# EAGLE design tanfolyamrobot (EAGLE 9.6.2)
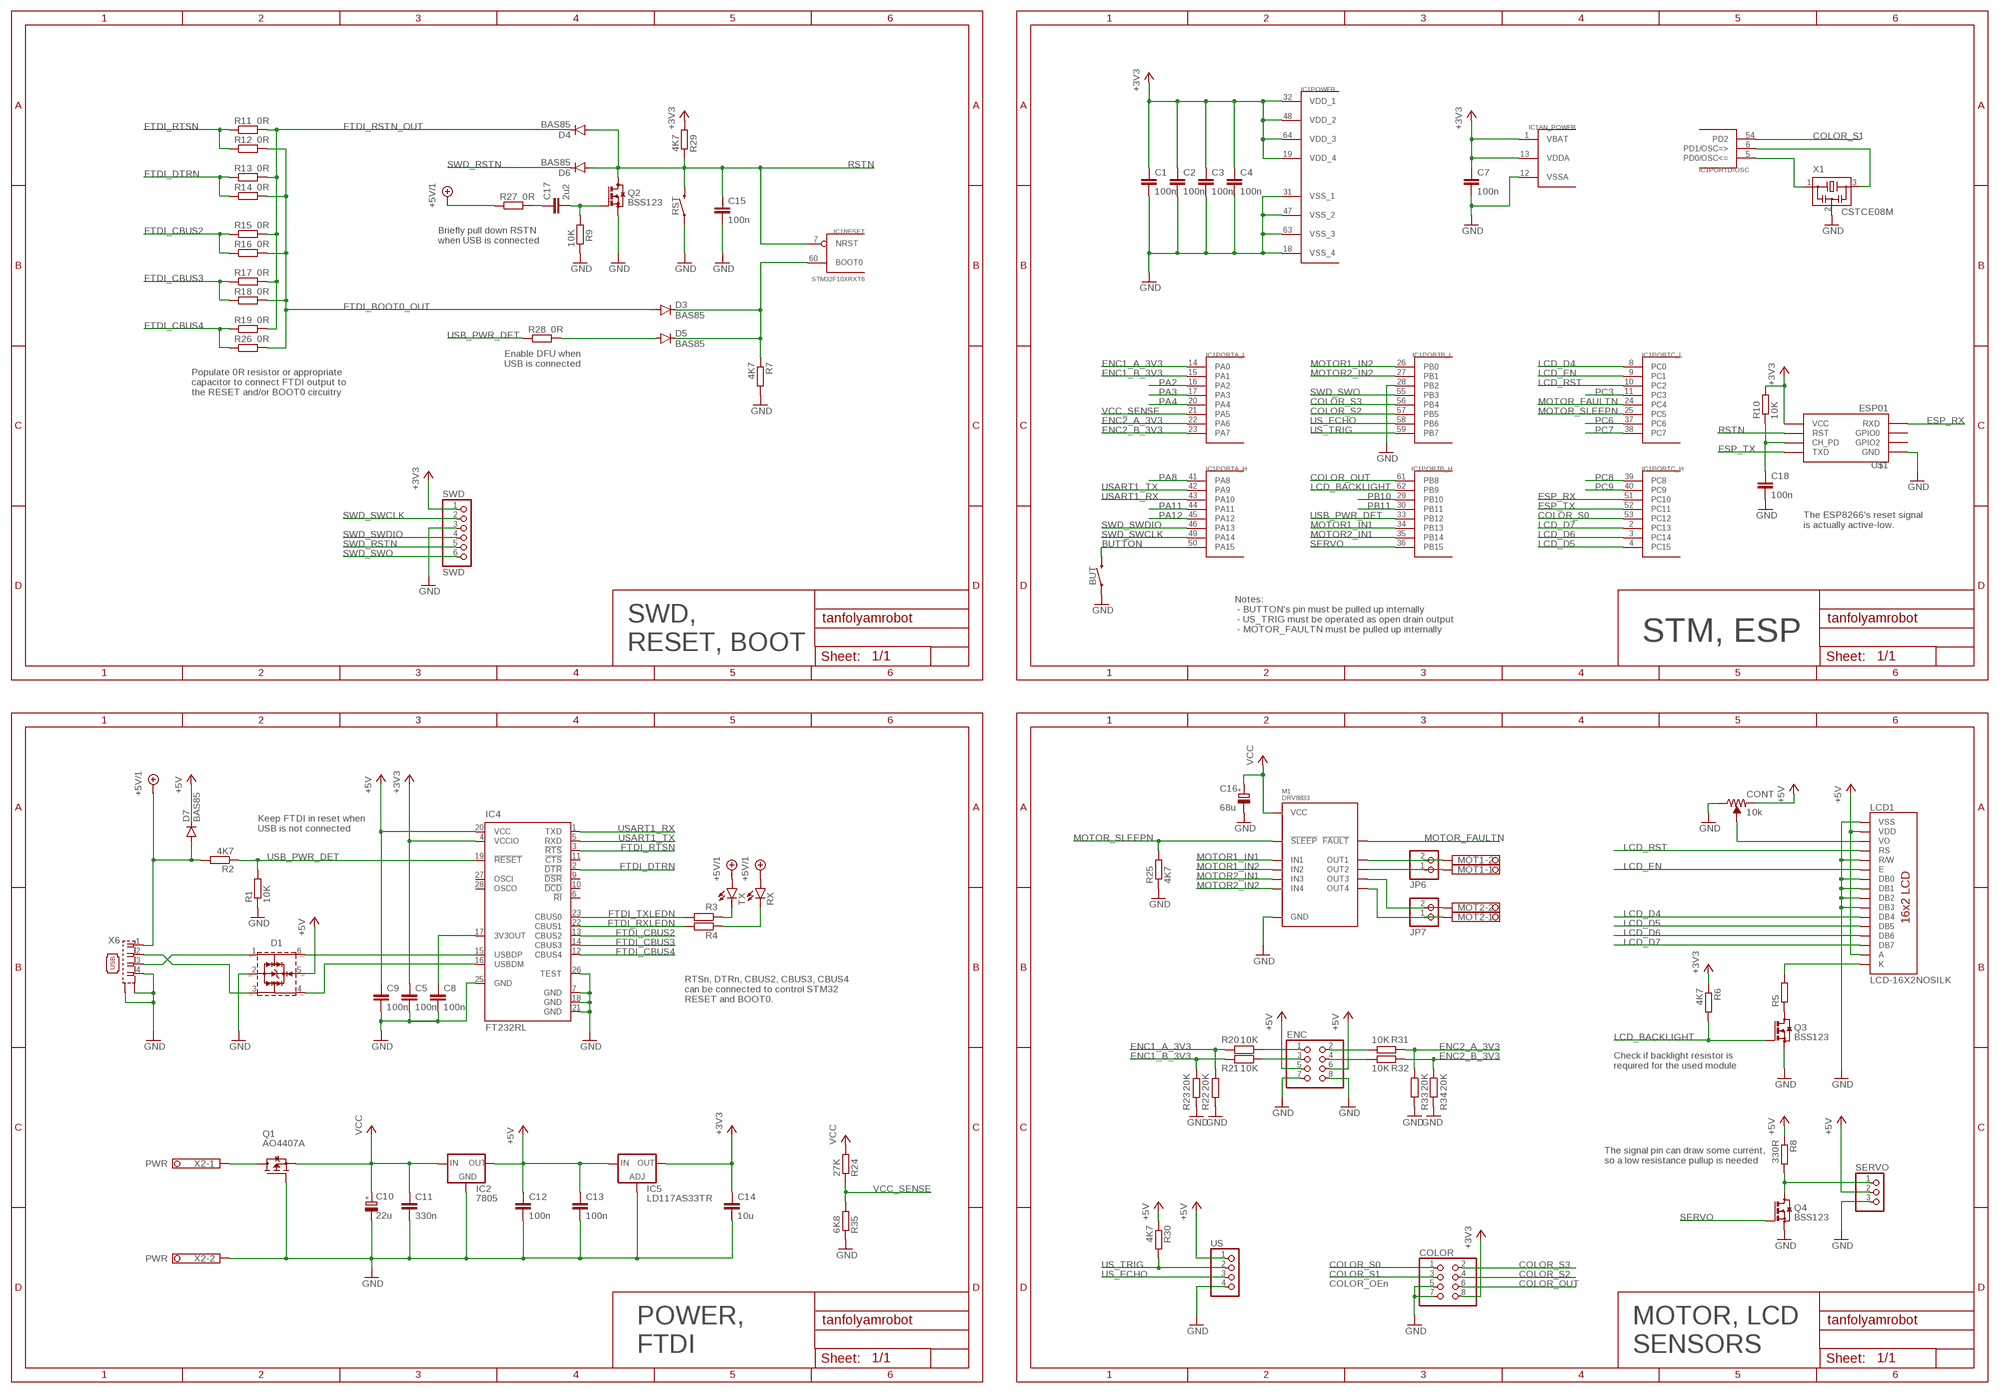
[diagram p0: schematic, sheet 1]

## Parts
BUT  MOMENTARY-SWITCH-SPST-PTH-6.0MM  [TACTILE_SWITCH_PTH_6.0MM]
C1  100n  C-EUC0603  [C0603]
C2  100n  C-EUC0603  [C0603]
C3  100n  C-EUC0603  [C0603]
C4  100n  C-EUC0603  [C0603]
C5  100n  C-EUC0603  [C0603]
C7  100n  C-EUC0603  [C0603]
C8  100n  C-EUC0603  [C0603]
C9  100n  C-EUC0603  [C0603]
C10  22u  CPOL-EUB/3528-21R  [B/3528-21R]
C11  330n  C-EUC0805K  [C0805K]
C12  100n  C-EUC0805K  [C0805K]
C13  100n  C-EUC0805K  [C0805K]
C14  10u  C-EUC0805K  [C0805K]
C15  100n  C-EUC0603  [C0603]
C16  68u  CPOL-EUB/3528-21R  [B/3528-21R]
C17  2u2  C-EUC0603  [C0603]
C18  100n  C-EUC0603  [C0603]
COLOR  PINHD-2X4/90  [2X04/90]
CONT  10k  TRIMPOT-SMD-3MM-CLOSED-1/8W-20%  [TRIMPOT-SMD-3MM-CLOSED]
D1  5Vdc  WE-TVS-HS_SOT23-6L_82400102  [WE-TVS_SOT23-6L]
D3  BAS85  DIODE-MICROMELF-W  [MICROMELF-W]
D4  BAS85  DIODE-MICROMELF-W  [MICROMELF-W]
D5  BAS85  DIODE-MICROMELF-W  [MICROMELF-W]
D6  BAS85  DIODE-MICROMELF-W  [MICROMELF-W]
D7  BAS85  DIODE-DO-214AC  [DO-214AC]
ENC  PINHD-2X4/90  [2X04/90]
IC1  STM32F10XRXT6  [TQFP64]
IC2  7805  LP2950CDT-3.0  [DPACK]
IC4  FT232RL  [SSOP28]
IC5  LD117AS33TR  [SOT223]
JP6  PINHD-1X2  [1X02]
JP7  PINHD-1X2  [1X02]
LCD1  LCD-16X2NOSILK  [LCD-16X2_NOSILK]
M1  DRV8833  [DRV8833_MODULE]
MOT1  PWR  1751248  [1751248]
MOT2  PWR  1751248  [1751248]
Q1  AO4407A  BSO201SP  [SO-8]
Q2  BSS123  [SOT23]
Q3  BSS123  [SOT23]
Q4  BSS123  [SOT23]
R1  10K  R-EU_R0603  [R0603]
R2  4K7  R-EU_R0603  [R0603]
R3  R-EU_R0603  [R0603]
R4  R-EU_R0603  [R0603]
R5  R-EU_R0603  [R0603]
R6  4K7  R-EU_R0603  [R0603]
R7  4K7  R-EU_R0603  [R0603]
R8  330R  R-EU_R0603  [R0603]
R9  10K  R-EU_R0603  [R0603]
R10  10K  R-EU_R0603  [R0603]
R11  0R  R-EU_R0603  [R0603]
R12  0R  R-EU_R0603  [R0603]
R13  0R  R-EU_R0603  [R0603]
R14  0R  R-EU_R0603  [R0603]
R15  0R  R-EU_R0603  [R0603]
R16  0R  R-EU_R0603  [R0603]
R17  0R  R-EU_R0603  [R0603]
R18  0R  R-EU_R0603  [R0603]
R19  0R  R-EU_R0603  [R0603]
R20  10K  R-EU_R0603  [R0603]
R21  10K  R-EU_R0603  [R0603]
R22  20K  R-EU_R0603  [R0603]
R23  20K  R-EU_R0603  [R0603]
R24  27K  R-EU_R0603  [R0603]
R25  4K7  R-EU_R0603  [R0603]
R26  0R  R-EU_R0603  [R0603]
R27  0R  R-EU_R0603  [R0603]
R28  0R  R-EU_R0603  [R0603]
R29  4K7  R-EU_R0603  [R0603]
R30  4K7  R-EU_R0603  [R0603]
R31  10K  R-EU_R0603  [R0603]
R32  10K  R-EU_R0603  [R0603]
R33  20K  R-EU_R0603  [R0603]
R34  20K  R-EU_R0603  [R0603]
R35  6K8  R-EU_R0603  [R0603]
RST  MOMENTARY-SWITCH-SPST-PTH-6.0MM  [TACTILE_SWITCH_PTH_6.0MM]
RX  LEDCHIP-LED0603  [CHIP-LED0603]
SERVO  PINHD-1X3/90  [1X03/90]
SWD  SWD  PINHD-1X6  [1X06]
TX  LEDCHIP-LED0603  [CHIP-LED0603]
U$1  ESP01  [ESP01]
US  PINHD-1X4/90  [1X04/90]
X1  CSTCE08M  MURATA_CSTCE  [CSTCE]
X2  PWR  1751248  [1751248]
X6  KUSBVX-BS1N  [KUSBVX-BS1N]

## Nets
3V3_FTDI: C8.1 IC4.17(3V3OUT)
+3V3: C1.1 C2.1 C3.1 C4.1 C5.1 C7.1 C14.1 COLOR.8 IC1.1(AN_POWER:VBAT) IC1.13(AN_POWER:VDDA) IC1.19(POWER:VDD_4) IC1.32(POWER:VDD_1) IC1.48(POWER:VDD_2) IC1.64(POWER:VDD_3) IC4.4(VCCIO) IC5.4(OUT) R6.1 R10.2 R29.1 SWD.1 U$1.VCC
+5V: C9.1 C12.1 C13.1 CONT.1(CCW) D1.5(VDD) D7.C ENC.5 ENC.6 IC2.3(OUT) IC4.20(VCC) IC5.3(IN) LCD1.2(VDD) LCD1.15(A) R8.1 R30.1 SERVO.2 US.1
+5V/1: D7.A R2.2 R27.1 RX.A TX.A X6.1
BOOT0: D3.C D5.C IC1.60(RESET:BOOT0) R7.1
BUTTON: BUT.3 IC1.50(PORTA_H:PA15)
COLOR_OUT: COLOR.6 IC1.61(PORTB_H:PB8)
COLOR_S0: COLOR.1 IC1.53(PORTC_H:PC12)
COLOR_S1: COLOR.3 IC1.54(PORTD/OSC:PD2)
COLOR_S2: COLOR.4 IC1.57(PORTB_L:PB5)
COLOR_S3: COLOR.2 IC1.56(PORTB_L:PB4)
ENC1_A_3V3: IC1.14(PORTA_L:PA0) R20.2 R22.1
ENC1_A_5V: ENC.1 R20.1
ENC1_B_3V3: IC1.15(PORTA_L:PA1) R21.2 R23.1
ENC1_B_5V: ENC.3 R21.1
ENC2_A_3V3: IC1.22(PORTA_L:PA6) R31.2 R33.1
ENC2_A_5V: ENC.2 R31.1
ENC2_B_3V3: IC1.23(PORTA_L:PA7) R32.2 R34.1
ENC2_B_5V: ENC.4 R32.1
ESP_CHPD: C18.1 R10.1 U$1.CH_PD
ESP_RX: IC1.51(PORTC_H:PC10) U$1.RX(RXD)
ESP_TX: IC1.52(PORTC_H:PC11) U$1.TX(TXD)
FTDI_BOOT0_OUT: D3.A R12.2 R14.2 R16.2 R18.2 R26.2
FTDI_CBUS2: IC4.13(CBUS2) R15.1 R16.1
FTDI_CBUS3: IC4.14(CBUS3) R17.1 R18.1
FTDI_CBUS4: IC4.12(CBUS4) R19.1 R26.1
FTDI_DTRN: IC4.2(!DTR) R13.1 R14.1
FTDI_RSTN_OUT: D4.C R11.2 R13.2 R15.2 R17.2 R19.2
FTDI_RTSN: IC4.3(!RTS) R11.1 R12.1
FTDI_RXLEDN: IC4.22(CBUS1) R4.2
FTDI_RXLEDN_R: R4.1 RX.C
FTDI_TXLEDN: IC4.23(CBUS0) R3.2
FTDI_TXLEDN_R: R3.1 TX.C
GND: BUT.1 C1.2 C2.2 C3.2 C4.2 C5.2 C7.2 C8.2 C9.2 C10.- C11.2 C12.2 C13.2 C14.2 C15.2 C16.- C18.2 COLOR.5 COLOR.7 CONT.3(CW) D1.2(GND) ENC.7 ENC.8 IC1.12(AN_POWER:VSSA) IC1.18(POWER:VSS_4) IC1.28(PORTB_L:PB2) IC1.31(POWER:VSS_1) IC1.47(POWER:VSS_2) IC1.63(POWER:VSS_3) IC2.4(GND) IC4.7(GND) IC4.18(GND) IC4.21(GND) IC4.25(GND) IC4.26(TEST) IC5.1(ADJ) LCD1.1(VSS) LCD1.5(R/W) LCD1.7(DB0) LCD1.8(DB1) LCD1.9(DB2) LCD1.10(DB3) M1.GND Q1.4(G) Q2.2(S) Q3.2(S) Q4.2(S) R1.1 R7.2 R9.2 R22.2 R23.2 R25.1 R33.2 R34.2 R35.2 RST.1 SERVO.3 SWD.3 U$1.GND US.4 X1.2 X2.2 X6.4 X6.M1(S1) X6.M2(S2)
LCD_BACKLIGHT: IC1.62(PORTB_H:PB9) Q3.1(G) R6.2
LCD_CONTRAST: CONT.2(WIPER) LCD1.3(VO)
LCD_D4: IC1.8(PORTC_L:PC0) LCD1.11(DB4)
LCD_D5: IC1.4(PORTC_H:PC15) LCD1.12(DB5)
LCD_D6: IC1.3(PORTC_H:PC14) LCD1.13(DB6)
LCD_D7: IC1.2(PORTC_H:PC13) LCD1.14(DB7)
LCD_EN: IC1.9(PORTC_L:PC1) LCD1.6(E)
LCD_K: LCD1.16(K) R5.2
LCD_RST: IC1.10(PORTC_L:PC2) LCD1.4(RS)
MOTOR1_IN1: IC1.34(PORTB_H:PB13) M1.IN1
MOTOR1_IN2: IC1.26(PORTB_L:PB0) M1.IN2
MOTOR2_IN1: IC1.35(PORTB_H:PB14) M1.IN3
MOTOR2_IN2: IC1.27(PORTB_L:PB1) M1.IN4
MOTOR_FAULTN: IC1.24(PORTC_L:PC4) M1.!FAULT
MOTOR_SLEEPN: IC1.25(PORTC_L:PC5) M1.!SLEEP R25.2
N$1: Q3.3(D) R5.1
N$2: C17.2 Q2.1(G) R9.1
N$3: Q1.5(D) Q1.6(D) Q1.7(D) Q1.8(D) X2.1
N$4: C17.1 R27.2
N$8: D5.A R28.2
N$12: JP6.2 M1.OUT1 MOT1.2
N$13: JP6.1 M1.OUT2 MOT1.1
N$14: JP7.2 M1.OUT3 MOT2.2
N$15: JP7.1 M1.OUT4 MOT2.1
OSCIN: IC1.5(PORTD/OSC:PD0/OSC<=) X1.1
OSCOUT: IC1.6(PORTD/OSC:PD1/OSC=>) X1.3
PA2: IC1.16(PORTA_L:PA2)
PA3: IC1.17(PORTA_L:PA3)
PA4: IC1.20(PORTA_L:PA4)
PA8: IC1.41(PORTA_H:PA8)
PA11: IC1.44(PORTA_H:PA11)
PA12: IC1.45(PORTA_H:PA12)
PB10: IC1.29(PORTB_H:PB10)
PB11: IC1.30(PORTB_H:PB11)
PC3: IC1.11(PORTC_L:PC3)
PC6: IC1.37(PORTC_L:PC6)
PC7: IC1.38(PORTC_L:PC7)
PC8: IC1.39(PORTC_H:PC8)
PC9: IC1.40(PORTC_H:PC9)
RSTN: C15.1 D4.A D6.A IC1.7(RESET:NRST) Q2.3(D) R29.2 RST.3 U$1.RST
SERVO: IC1.36(PORTB_H:PB15) Q4.1(G)
SERVO_5V: Q4.3(D) R8.2 SERVO.1
SWD_RSTN: D6.C SWD.5
SWD_SWCLK: IC1.49(PORTA_H:PA14) SWD.2
SWD_SWDIO: IC1.46(PORTA_H:PA13) SWD.4
SWD_SWO: IC1.55(PORTB_L:PB3) SWD.6
US_ECHO: IC1.58(PORTB_L:PB6) US.3
US_TRIG: IC1.59(PORTB_L:PB7) R30.2 US.2
USART1_RX: IC1.43(PORTA_H:PA10) IC4.1(TXD)
USART1_TX: IC1.42(PORTA_H:PA9) IC4.5(RXD)
USB_DM: D1.3(I/O2) X6.2
USB_DM_FTDI: D1.4(I/O4) IC4.16(USBDM)
USB_DP: D1.1(I/O1) X6.3
USB_DP_FTDI: D1.6(I/O3) IC4.15(USBDP)
USB_PWR_DET: IC1.33(PORTB_H:PB12) IC4.19(!RESET) R1.2 R2.1 R28.1
VCC: C10.+ C11.1 C16.+ IC2.1(IN) M1.VCC Q1.1(S) Q1.2(S) Q1.3(S) R24.1
VCC_SENSE: IC1.21(PORTA_L:PA5) R24.2 R35.1
Unconnected: IC4.6(!RI) IC4.9(!DSR) IC4.10(!DCD) IC4.11(!CTS) IC4.27(OSCI) IC4.28(OSCO) U$1.GPIO0 U$1.GPIO2

## Notes on the sheet
- Briefly pull down RSTN
  when USB is connected
- Enable DFU when
  USB is connected
- Populate 0R resistor or appropriate 
  capacitor to connect FTDI output to 
  the RESET and/or BOOT0 circuitry
- The ESP8266's reset signal 
  is actually active-low.
- Notes:
   - BUTTON's pin must be pulled up internally
   - US_TRIG must be operated as open drain output
   - MOTOR_FAULTN must be pulled up internally
- STM, ESP
- SWD,
  RESET, BOOT
- Keep FTDI in reset when 
  USB is not connected
- RTSn, DTRn, CBUS2, CBUS3, CBUS4 
  can be connected to control STM32
  RESET and BOOT0.
- Check if backlight resistor is 
  required for the used module
- The signal pin can draw some current,
  so a low resistance pullup is needed
- COLOR_OEn
- POWER, 
  FTDI
- MOTOR, LCD
  SENSORS

## Library data of the parts
BUT RST = SparkFun-Switches:MOMENTARY-SWITCH-SPST: Momentary Switch (Pushbutton) - SPST Normally-open (NO) SPST momentary switches (buttons, pushbuttons). Variants PTH-12MM - 12mm square, through-hole Momentary Pushbutton Switch - 12mm Square (COM-09190) PTH-6.0MM, PTH-6.0MM-KIT - 6.0mm square, through-hole Mini Pushbutton Switch (COM-00097) KIT package intended for soldering kit's - only one side of pads' copper is exposed. PTH-RIGHT-ANGLE-KIT - Right-angle, through-hole Right Angle Tactile Button - Used on SparkFun BigTime Watch Kit SMD-12MM - 12mm square, surface-mount Tactile Button - SMD (12mm) (COM-12993) Used on SparkFun PicoBoard SMD-4.5MM - 4.5mm Square Trackball Switch Used on SparkFun Blackberry Trackballer Breakout SMD-4.6MMX2.8MM - 4.60mm x 2.80mm, surface mount Used on SparkFun SAMD21 Mini Breakout SMD-5.2MM, SMD-5.2-REDUNDANT - 5.2mm square, surface-mount Mini Pushbutton Switch - SMD (COM-08720) Used on Arduino Pro Mini REDUNDANT package connects both switch circuits together SMD-6.0X3.5MM - 6.0 x 3.5mm, surface mount Momentary Reset Switch SMD (COM-08229) SMD-6.2MM-TALL - 6.2mm square, surface mount Tactile Button - SMD (6mm) Used on SparkFun Digital Sandbox SMD-RIGHT-ANGLE - Right-angle, surface mount Used on SparkFun Block for Intel® Edison - Arduino; PROD_ID: SWCH-08441; SF_SKU: COM-00097
C1-C5 C7-C9 C11-C15 C17 C18 = rcl:C-EU: CAPACITOR, European symbol; SPICEPREFIX: C
C10 C16 = rcl:CPOL-EU: POLARIZED CAPACITOR, European symbol; SPICEPREFIX: C
COLOR ENC = pinhead:PINHD-2X4: PIN HEADER
CONT = SparkFun-Resistors:TRIMPOT: Trimming Potentiometer (Trimpot) Three-terminal potentiometers, with an adjustable wiper and two adjustable resistors. A pot can be used to create a configurable voltage divider, or as a variable resistor. "Trimpots" are a subset of potentiometers, usually intended for "set-and-forget" applications. They're often more delicate than standard potentiometers - rated for fewer turns. Variants PTH-KNOB - PTH Trimpot w/ finger-adjustable knob Trimpot 10K with Knob (COM-09806) Datasheet SMD-3MM-CLOSED-FRAME - SMD 3mm Square Closed-Frame Trimpot Used on e.g. EasyDriver - Stepper Motor Driver Datasheet (22AR10KTR) SMD-5MM - SMD 5mm Square Closed-Frame Trimpot Used on e.g. IOIO-OTG - V2.2 Datasheet (TS53YL502MR10) SMD-3MM-1/10W-25% - 3mm Square Open-Frame Trimpot Used on e.g. SparkFun Shapeoko Datasheet (TC33X-2-103E); PROD_ID: RES-09285
D1 = Wurth_EMC Components_WE-TVS:WE-TVS-HS_SOT23-6L_82400102: WE-TVS TVS Diode – High Speed Series Characteristics Low clamping voltage Sturdy design Very low capacitance Flow Thru Design for a simple layout Rail to Rail protection Epoxy flame resistant UL94-V0 RoHS, REACH and free of halogens Applications Very fast data lines USB 2.0 Ethernet PoE VGA Sim Cards Keypads HS = High Speed Details see: https://katalog.we-online.com/en/pbs/WE-TVS-HS Updated by Ella Wu 2019-07-12 2019 (C) Wurth Elektronik; C-CH: 2pF; CHANNELS: 2+1; DATASHEET-URL: https://katalog.we-online.com/pbs/datasheet/82400102.pdf; IPEAK: 6A; MOUNT: SMT; PART-NUMBER: 82400102; VBR: 6V
D3-D7 = diode:DIODE-: DIODE
IC1 = stm32:STM32F10XRXT6: STM32F101/103 64pin LQFP
IC2 = v-reg:LP2950?*: Source: http://cache.national.com/ds/LP/LP2950.pdf
IC4 = ftdichip:FT232R: Source: http://www.ftdichip.com/Documents/DataSheets/DS_FT232R_v104.pdf; MPN: FT232RL; OC_FARNELL: 1146032; OC_NEWARK: 91K9918
IC5 = v-reg:LD117A?*: Low drop fixed and adjustable positive voltage regulators 1 A Source: http://www.st.com/stonline/products/literature/ds/7194/ld1117axx.pdf
JP6 JP7 = pinhead:PINHD-1X2: PIN HEADER
LCD1 = SparkFun-Displays:LCD-16X2: Standard text-only 16x2 parallel input LCD Basic 16 character by 2 line display. Typically utilizes the extremely common HD44780 parallel interface chipset SparkFun Products: Basic 16x2 Green Basic 8x2 Green; SF_ID: LCD-00255
M1 = motordriver:DRV8833
MOT1 MOT2 X2 = con-phoenix-350:1751248: MKDS 1/ 2-3,5 Printklemme Nennstrom: 10 A Bemessungsspannung: 160 V Raster: 3,5 mm Polzahl: 2 Montageart: Löten Anschlussart: Schraubanschluss Anschlussrichtung vom Leiter zur Platine: 0° Source: http://eshop.phoenixcontact.com .. 1751248.pdf; OC_FARNELL: unknown; OC_NEWARK: unknown
Q1 = transistor-fet:BSO201SP: OptiMOS(R)-P Small-Signal-Transistor P-Channel, Enhancement mode, Super Logic Level (2.5 V rated) RDS(on) 8mOhm, ID -14.9 a Source: http://www.infineon.com/upload/Document/cmc_upload/documents/011/3655/BSO201SP_211201.pdf
Q2-Q4 = transistor-small-signal:BSS123: N-CHANNEL MOS FET
R1-R35 = rcl:R-EU_: RESISTOR, European symbol; SPICEPREFIX: R
RX TX = led:LED: LED OSRAM: - CHIPLED LG R971, LG N971, LY N971, LG Q971, LY Q971, LO R971, LY R971 LH N974, LH R974 LS Q976, LO Q976, LY Q976 LO Q996 - Hyper CHIPLED LW Q18S LB Q993, LB Q99A, LB R99A - SideLED LS A670, LO A670, LY A670, LG A670, LP A670 LB A673, LV A673, LT A673, LW A673 LH A674 LY A675 LS A676, LA A676, LO A676, LY A676, LW A676 LS A679, LY A679, LG A679 - Hyper Micro SIDELED® LS Y876, LA Y876, LO Y876, LY Y876 LT Y87S - SmartLED LW L88C, LW L88S LB L89C, LB L89S, LG L890 LS L89K, LO L89K, LY L89K LS L896, LA L896, LO L896, LY L896 - TOPLED LS T670, LO T670, LY T670, LG T670, LP T670 LSG T670, LSP T670, LSY T670, LOP T670, LYG T670 LG T671, LOG T671, LSG T671 LB T673, LV T673, LT T673, LW T673 LH T674 LS T676, LA T676, LO T676, LY T676, LB T676, LH T676, LSB T676, LW T676 LB T67C, LV T67C, LT T67C, LS T67K, LO T67K, LY T67K, LW E67C LS E67B, LA E67B, LO E67B, LY E67B, LB E67C, LV E67C, LT E67C LW T67C LS T679, LY T679, LG T679 LS T770, LO T770, LY T770, LG T770, LP T770 LB T773, LV T773, LT T773, LW T773 LH T774 LS E675, LA E675, LY E675, LS T675 LS T776, LA T776, LO T776, LY T776, LB T776 LHGB T686 LT T68C, LB T68C - Hyper Mini TOPLED® LB M676 - Mini TOPLED Santana® LG M470 LS M47K, LO M47K, LY M47K Source: http://www.osram.convergy.de LUXEON: - LUMILED® LXK2-PW12-R00, LXK2-PW12-S00, LXK2-PW14-U00, LXK2-PW14-V00 LXK2-PM12-R00, LXK2-PM12-S00, LXK2-PM14-U00 LXK2-PE12-Q00, LXK2-PE12-R00, LXK2-PE12-S00, LXK2-PE14-T00, LXK2-PE14-U00 LXK2-PB12-K00, LXK2-PB12-L00, LXK2-PB12-M00, LXK2-PB14-N00, LXK2-PB14-P00, LXK2-PB14-Q00 LXK2-PR12-L00, LXK2-PR12-M00, LXK2-PR14-Q00, LXK2-PR14-R00 LXK2-PD12-Q00, LXK2-PD12-R00, LXK2-PD12-S00 LXK2-PH12-R00, LXK2-PH12-S00 LXK2-PL12-P00, LXK2-PL12-Q00, LXK2-PL12-R00 Source: www.luxeon.com KINGBRIGHT: KA-3528ASYC Source: www.kingbright.com
SERVO = pinhead:PINHD-1X3: PIN HEADER
SWD = pinhead:PINHD-1X6: PIN HEADER
U$1 = esp8266modules:ESP01: ESP8266 Wifi module 01
US = pinhead:PINHD-1X4: PIN HEADER
X1 = resonator:MURATA_CSTCE
X6 = con-kycon:KUSBVX-BS1N: USB B-type Receptacle Vertical, 4 Position, Through Hole Source: Sibalco Kycon KUSBVX-BS1N-xxx.pdf

## Board
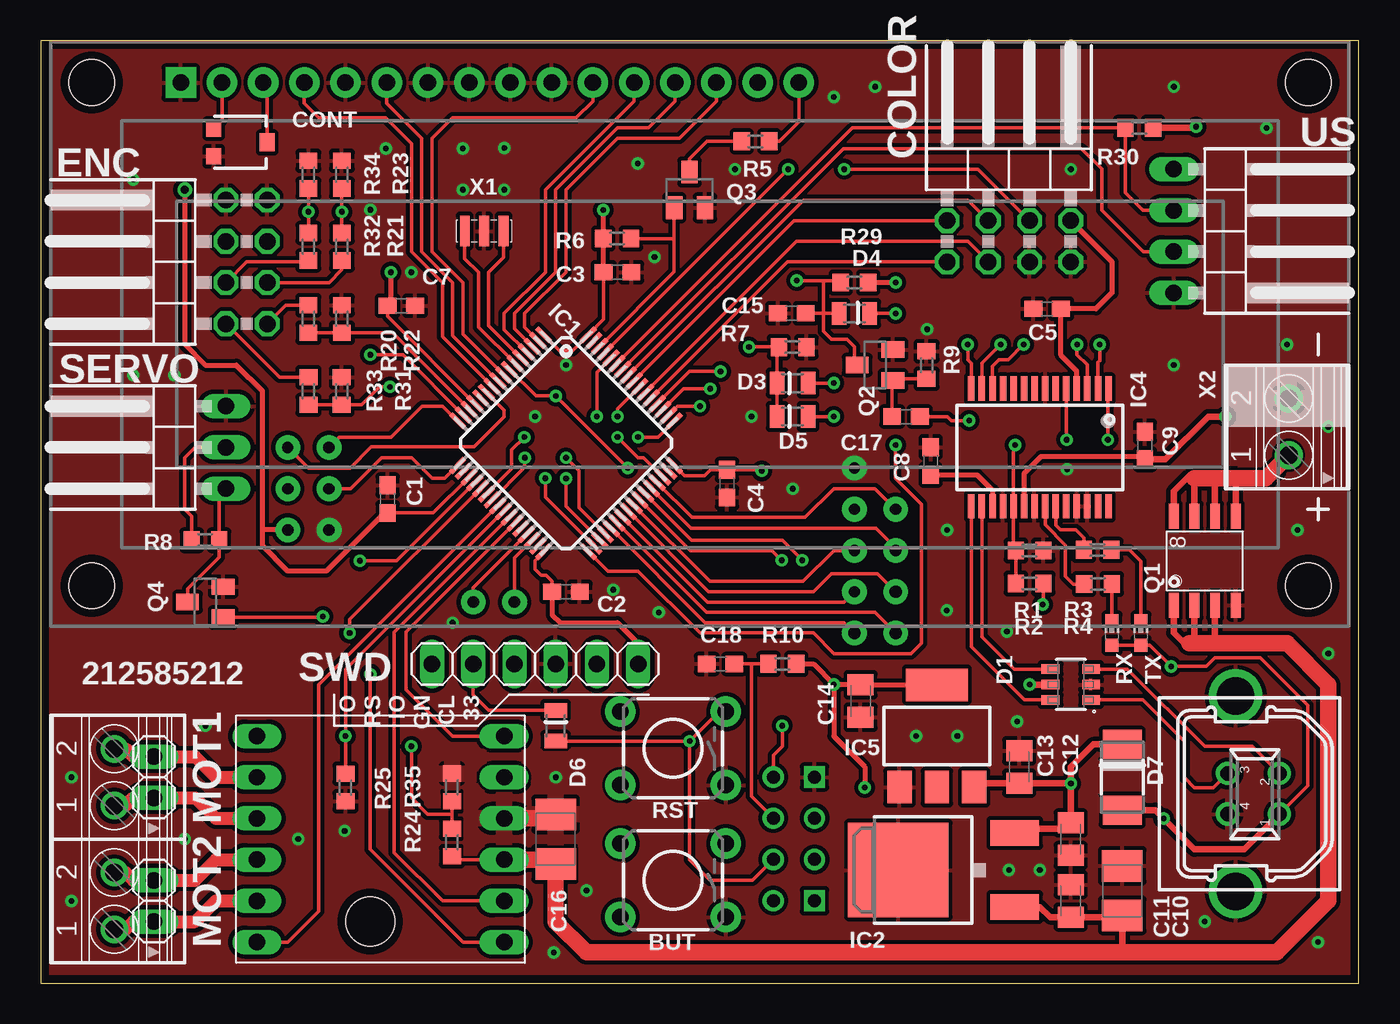
[diagram p1: board, top side]
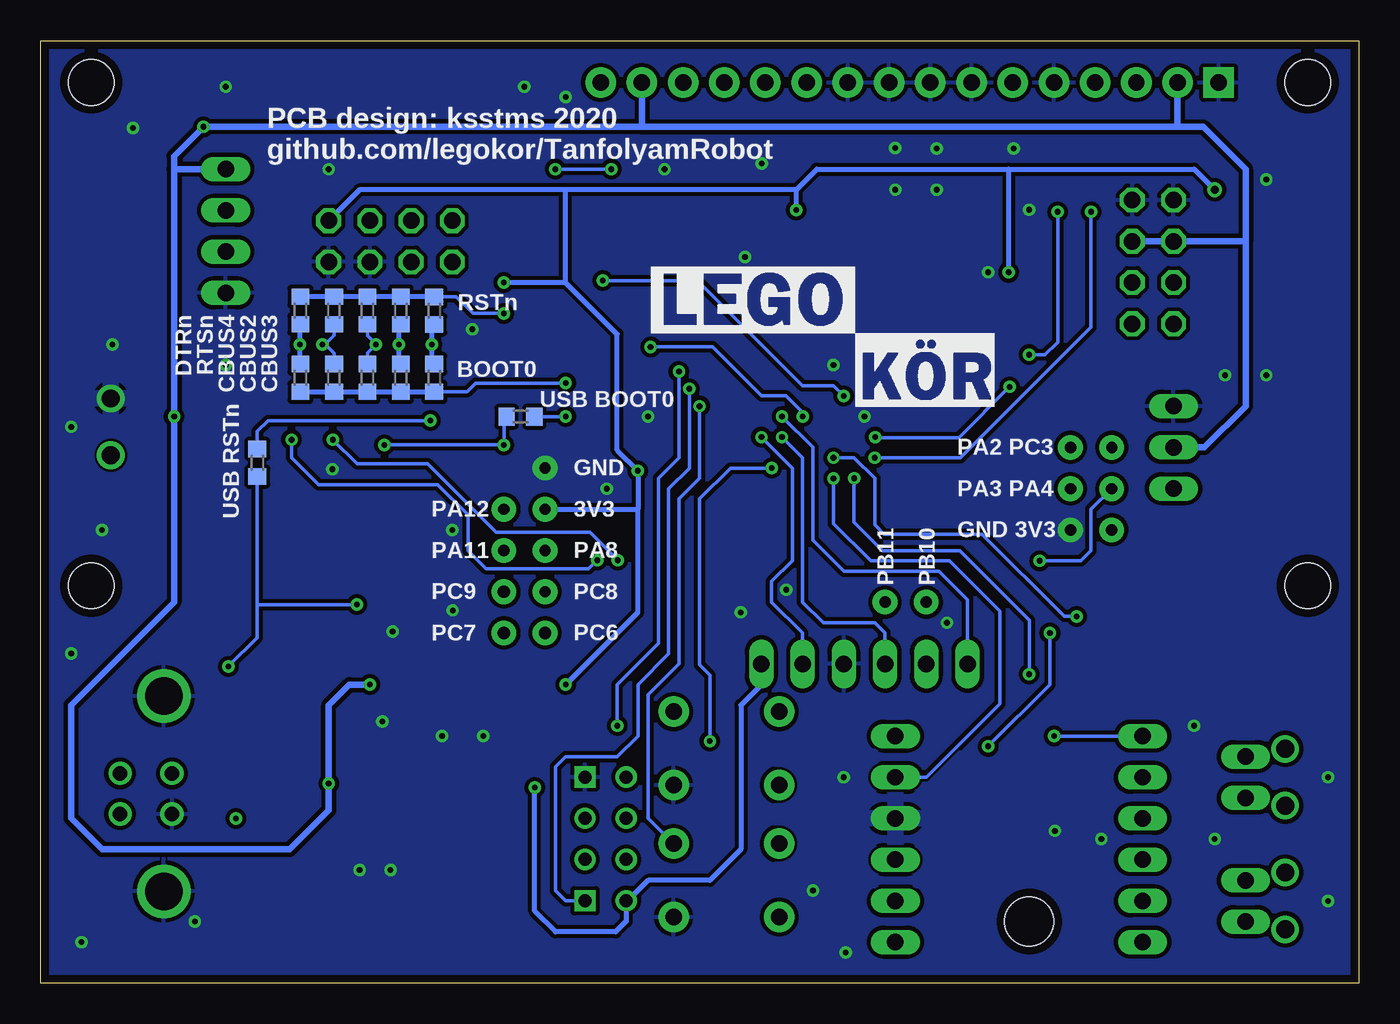
[diagram p2: board, bottom side, seen from below]

Size 81.26 x 58.09 mm. Coordinates in mm from the lower left corner, seen from the top.
Outline: 0,0 81.26,0 81.26,58.09 0,58.09 0,0
Copper layers (1*16): Top 0.035mm / dielectric 1.5mm / Bottom 0.035mm
Design rules "jlc? *": minimum track width 6mil, minimum drill 0.35mm, track to track 6mil, track to pad 6mil, pad to pad 6mil, via to via 6mil, smd to smd 6mil, copper to edge 20mil, drill to drill 6mil, minimum pad ring 10mil, minimum via ring 8mil, stop-mask expansion 4mil, vias tented up to drill 0mil, thermal gap 10mil
Holes 3 mm at 20.32,3.81

### Footprints (pad centres in the part's own frame; a part is rotated, then mirrored left to right if it is on the bottom)
TACTILE_SWITCH_PTH_6.0MM = drill 1.016 pad 1.88: 1 -3.251,2.261; 2 3.251,2.261; 3 -3.251,-2.261; 4 3.251,-2.261
C0603 = smd 1.1 x 1: 1 -0.85,0; 2 0.85,0
B/3528-21R = smd 1.95 x 2.5: + 1.525,0; - -1.525,0
C0805K = smd 1.3 x 1.6: 1 -1,0; 2 1,0
2X04/90 = drill 1.016 octagon: 1 -3.81,-6.35; 2 -3.81,-3.81; 3 -1.27,-6.35; 4 -1.27,-3.81; 5 1.27,-6.35; 6 1.27,-3.81; 7 3.81,-6.35; 8 3.81,-3.81
TRIMPOT-SMD-3MM-CLOSED = smd 1 x 0.9: 1 -0.85,-1.65; 3 0.85,-1.65 | smd 1.1 x 0.9: 2 0,1.65
WE-TVS_SOT23-6L = smd 0.6 x 1.1: 1 -0.95,-1.25; 2 0,-1.25; 3 0.95,-1.25; 4 0.95,1.25; 5 0,1.25; 6 -0.95,1.25
MICROMELF-W = smd 0.9 x 1.4: A 0.95,0; C -0.95,0
DO-214AC = smd 1.8 x 2.4: A 2.025,0; C -2.025,0
TQFP64 = smd 1.2 x 0.3: 1 -5.7,3.75; 2 -5.7,3.25; 3 -5.7,2.75; 4 -5.7,2.25; 5 -5.7,1.75; 6 -5.7,1.25; 7 -5.7,0.75; 8 -5.7,0.25; 9 -5.7,-0.25; 10 -5.7,-0.75; 11 -5.7,-1.25; 12 -5.7,-1.75; 13 -5.7,-2.25; 14 -5.7,-2.75; 15 -5.7,-3.25; 16 -5.7,-3.75; 33 5.7,-3.75; 34 5.7,-3.25; 35 5.7,-2.75; 36 5.7,-2.25; 37 5.7,-1.75; 38 5.7,-1.25; 39 5.7,-0.75; 40 5.7,-0.25; 41 5.7,0.25; 42 5.7,0.75; 43 5.7,1.25; 44 5.7,1.75; 45 5.7,2.25; 46 5.7,2.75; 47 5.7,3.25; 48 5.7,3.75 | smd 0.3 x 1.2: 17 -3.75,-5.7; 18 -3.25,-5.7; 19 -2.75,-5.7; 20 -2.25,-5.7; 21 -1.75,-5.7; 22 -1.25,-5.7; 23 -0.75,-5.7; 24 -0.25,-5.7; 25 0.25,-5.7; 26 0.75,-5.7; 27 1.25,-5.7; 28 1.75,-5.7; 29 2.25,-5.7; 30 2.75,-5.7; 31 3.25,-5.7; 32 3.75,-5.7; 49 3.75,5.7; 50 3.25,5.7; 51 2.75,5.7; 52 2.25,5.7; 53 1.75,5.7; 54 1.25,5.7; 55 0.75,5.7; 56 0.25,5.7; 57 -0.25,5.7; 58 -0.75,5.7; 59 -1.25,5.7; 60 -1.75,5.7; 61 -2.25,5.7; 62 -2.75,5.7; 63 -3.25,5.7; 64 -3.75,5.7
DPACK = smd 1.6 x 3: 1 -2.28,-4.8; 3 2.28,-4.8 | smd 5.8 x 6.2: 4 0,2.38
SSOP28 = smd 0.4 x 1.5: 1 -4.225,-3.625; 2 -3.575,-3.625; 3 -2.925,-3.625; 4 -2.275,-3.625; 5 -1.625,-3.625; 6 -0.975,-3.625; 7 -0.325,-3.625; 8 0.325,-3.625; 9 0.975,-3.625; 10 1.625,-3.625; 11 2.275,-3.625; 12 2.925,-3.625; 13 3.575,-3.625; 14 4.225,-3.625; 15 4.225,3.625; 16 3.575,3.625; 17 2.925,3.625; 18 2.275,3.625; 19 1.625,3.625; 20 0.975,3.625; 21 0.325,3.625; 22 -0.325,3.625; 23 -0.975,3.625; 24 -1.625,3.625; 25 -2.275,3.625; 26 -2.925,3.625; 27 -3.575,3.625; 28 -4.225,3.625
SOT223 = smd 1.5 x 2: 1 -2.3,-3.15; 2 0,-3.15; 3 2.3,-3.15 | smd 3.8 x 2: 4 0,3.15
1X02 = drill 1.016 long: 1 -1.27,0; 2 1.27,0
LCD-16X2_NOSILK = drill 1.016 pad 1.88 square: 1 -32,15.5 | drill 1.016 pad 1.88: 2 -29.46,15.5; 3 -26.92,15.5; 4 -24.38,15.5; 5 -21.84,15.5; 6 -19.3,15.5; 7 -16.76,15.5; 8 -14.22,15.5; 9 -11.68,15.5; 10 -9.14,15.5; 11 -6.6,15.5; 12 -4.06,15.5; 13 -1.52,15.5; 14 1.02,15.5; 15 3.56,15.5; 16 6.1,15.5 | hole 2.8: -37.5,15.5; -37.5,-15.5; 37.5,15.5; 37.5,-15.5
DRV8833_MODULE = drill 1.016 long: !FAULT -7.62,-6.35; !SLEEP -7.62,6.35; GND 7.62,1.27; IN1 7.62,-6.35; IN2 7.62,-3.81; IN3 7.62,3.81; IN4 7.62,6.35; OUT1 -7.62,3.81; OUT2 -7.62,1.27; OUT3 -7.62,-1.27; OUT4 -7.62,-3.81; VCC 7.62,-1.27
1751248 = drill 1.1 pad 1.7: 1 -1.75,-0.1; 2 1.75,-0.1
SO-8 = smd 1.524 x 0.61: 1 -2.743,1.905; 2 -2.743,0.635; 3 -2.743,-0.635; 4 -2.743,-1.905; 5 2.743,-1.905; 6 2.743,-0.635; 7 2.743,0.635; 8 2.743,1.905
SOT23 = smd 1 x 1.4: 1 -0.95,-1.1; 2 0.95,-1.1; 3 0,1.1
R0603 = smd 1 x 1.1: 1 -0.85,0; 2 0.85,0
CHIP-LED0603 = smd 0.8 x 0.8: A 0,-0.75; C 0,0.75
1X03/90 = drill 1.016 long: 1 -2.54,-3.81; 2 0,-3.81; 3 2.54,-3.81
1X06 = drill 1.016 long: 1 -6.35,0; 2 -3.81,0; 3 -1.27,0; 4 1.27,0; 5 3.81,0; 6 6.35,0
ESP01 = drill 0.8: CH_PD -1.285,-8.178; GPIO0 1.255,-5.638; GPIO2 -1.285,-5.638; RST 1.255,-8.178; TX -3.825,-8.178; VCC 3.795,-8.178 | drill 0.8 square: GND -3.825,-5.638; RX 3.795,-5.638
1X04/90 = drill 1.016 long: 1 -3.81,-3.81; 2 -1.27,-3.81; 3 1.27,-3.81; 4 3.81,-3.81
CSTCE = smd 0.6 x 1.89: 1 -1.2,0 | smd 0.6 x 1.9: 2 0,0; 3 1.2,0
KUSBVX-BS1N = drill 0.9 pad 1.422: 1 1.25,2.7; 2 -1.25,2.7; 3 -1.25,-0.5; 4 1.25,-0.5 | drill 2.3 pad 2.7: M1 -6.02,0; M2 6.02,0

### Placement (x,y rotation side)
BUT  38.99,6.35 180 top
C1  21.39,29.83 90 top
C2  32.38,24.13 0 top
C3  35.56,43.81 0 top
C4  42.31,30.79 270 top
C5  62.05,41.56 180 top
C7  22.24,41.75 0 top
C8  54.86,32.19 90 top
C9  68.07,33.15 90 top
C10  66.67,5.71 270 top
C11  63.5,5.08 90 top
C12  63.5,8.89 270 top
C13  60.33,13.34 90 top
C14  50.55,17.4 270 top
C15  46.31,41.29 180 top
C16  31.75,8.89 270 top
C17  53.34,34.92 180 top
C18  41.91,19.68 180 top
COLOR  59.69,50.8 0 top
CONT  12.32,51.82 270 top
D1  63.5,18.41 90 top
D3  46.35,36.99 0 top
D4  50.16,41.27 180 top
D5  46.35,34.92 0 top
D6  31.75,15.88 270 top
D7  66.67,12.7 270 top
ENC  7.62,44.45 90 top
IC1  32.38,33.28 315 top
IC2  55.24,6.99 90 top
IC4  61.59,33.02 180 top
IC5  55.24,15.24 0 top
JP6  6.99,12.7 90 top
JP7  6.99,5.08 90 top
LCD1  40.64,40.01 0 top
M1  20.95,8.89 0 top
MOT1  4.45,12.7 90 top
MOT2  4.45,5.08 90 top
Q1  71.75,26.04 90 top
Q2  51.44,38.1 90 top
Q3  40.01,48.9 0 top
Q4  10.16,23.5 90 top
R1  60.96,26.67 180 top
R2  60.96,24.64 0 top
R3  65.15,26.71 180 top
R4  65.18,24.61 180 top
R5  44.06,51.88 0 top
R6  35.54,45.89 0 top
R7  46.35,39.2 0 top
R8  4K7  [R0603]  10.16,27.3 0 top
R9  54.61,38.1 90 top
R10  45.72,19.68 0 top
R11  63.18,41.46 90 bottom
R12  63.18,37.31 270 bottom
R13  65.25,41.46 90 bottom
R14  65.25,37.31 270 bottom
R15  59.05,41.46 90 bottom
R16  59.05,37.31 270 bottom
R17  56.99,41.44 90 bottom
R18  56.99,37.31 270 bottom
R19  61.12,41.46 90 bottom
R20  16.51,40.94 270 top
R21  18.57,45.38 90 top
R22  18.57,40.94 90 top
R23  18.57,49.83 90 top
R24  25.36,8.68 90 top
R25  18.8,12.06 90 top
R26  61.12,37.31 270 bottom
R27  67.9,32.07 90 bottom
R28  51.68,34.92 0 bottom
R29  50.16,43.18 180 top
R30  67.72,52.71 180 top
R31  16.51,36.49 270 top
R32  16.51,45.38 90 top
R33  18.56,36.49 90 top
R34  16.51,49.83 90 top
R35  25.36,12.08 90 top
RST  38.99,14.48 180 top
RX  66.04,21.59 0 top
SERVO  7.62,33.02 90 top
SWD  30.48,19.68 180 top
TX  67.82,21.59 0 top
U$1  53.34,8.89 270 top
US  73.66,46.35 270 top
X1  27.34,46.35 180 top
X2  76.83,34.29 90 top
X6  73.66,11.68 270 top

### Tracks (layer width: path | path; a pad name or v marks a point on that pad's centre or on a via)
3V3_FTDI
  Top 0.305: C8.1 57.72,31.34 58.67,30.39 IC4.17
+3V3  (via drill 0.35, 0.5 pad 0.7, 0.7 pad 1.52)
  Top 0.203: IC1.1 31.98,38.99 32.79,38.99 IC1.64 34.71,40.91 C3.1 | IC1.19 24.2,28.98 C1.1 | 44.34,31.69 v44.45,31.58 44.39,31.64 C4.1 41.29,31.64 40.92,31.27 39.7,31.27 IC1.48 | C2.1 31.54,24.77 31.15,25.15 30.86,25.15 30.48,25.53 30.48,26.04 31.01,26.56 IC1.32 | C7.1 21.39,41.1 IC1.13
  Top 0.305: v52.7,43.18 R29.1 | R10.2 47.62,19.68 v48.9,18.41 | v48.9,18.41 48.9,15.24 50.8,13.34 v50.8,12.06 | C2.1 31.54,22.69 32,22.23 35.56,22.23 36.83,20.95 SWD.1 | v48.9,18.41 48.91,18.4 C14.1 IC5.4 | IC4.4 63.87,37.73 62.9,38.7 C5.1 65.06,41.56 66.04,42.55 66.04,44.45 COLOR.8 | C3.1 34.71,45.87 R6.1 v34.69,47.63 v34.68,47.64 | C7.1 21.59,41.96 v21.59,43.81 | 21.18,29.2 C1.1 21.19,28.98 17.61,25.4 15.24,25.4 13.66,26.98 13.66,27.94 | v8.89,48.9 8.89,39.37 10.16,38.1 12.06,38.1 13.66,36.51 13.66,27.94 | v15.24,27.94 13.66,27.94
  Bottom 0.305: v50.8,12.06 50.8,4.45 49.53,3.17 45.81,3.17 45.16,3.83 U$1.VCC 45.07,5.09 43.81,6.35 40.01,6.35 38.1,8.26 38.1,17.14 36.83,18.41 SWD.1 | 44.45,29.21 v44.45,31.58 45.72,32.85 45.72,40.01 48.9,43.18 | v50.16,29.21 44.45,29.21 | v21.59,43.81 21.59,50.16 | v48.9,18.41 44.45,22.86 44.45,29.21 | 48.9,43.18 v52.7,43.18 | 48.9,43.18 48.9,48.9 | 34.68,48.9 48.9,48.9 | 48.9,48.9 61.59,48.9 COLOR.8 | v34.68,47.64 34.68,48.9 | 34.68,48.9 33.41,50.16 21.59,50.16 | 21.59,50.16 10.16,50.16 v8.89,48.9
+5V  (via drill 0.35)
  Top 0.203: CONT.1 11.18,53.18 LCD1.2 | SERVO.2 9.53,33.02 8.89,32.38 8.89,29.21 9.31,28.79 R8.1
  Top 0.305: C9.1 67.92,32.45 61.66,32.45 60.62,31.41 IC4.20
  Top 0.406: IC5.3 57.79,12.34 C13.1 63.48,12.34 v63.5,12.32 | v63.5,12.32 C12.1 63.13,9.53 60.3,9.53 IC2.3 | D7.C 64.89,14.72 63.5,13.34 v63.5,12.32 | v60.96,18.41 D1.5 | v73.03,34.92 71.97,34.92 69.34,32.3 C9.1 | R30.1 71.15,52.71 v71.21,52.78
  Bottom 0.406: LCD1.2 11.18,52.78 | 44.2,52.78 11.18,52.78 | US.1 73.03,50.16 | LCD1.15 44.2,52.78 | 73.03,50.16 v73.03,34.92 73.03,23.5 79.38,17.14 79.38,10.16 77.47,8.26 65.9,8.26 63.5,10.65 v63.5,12.32 63.5,17.14 62.23,18.41 v60.96,18.41 | 44.2,52.78 v71.21,52.78 73.03,50.97 73.03,50.16 | 11.18,52.78 9.6,52.78 6.99,50.16 6.99,45.72 | 6.99,45.72 ENC.6 ENC.5 | SERVO.2 9.53,33.02 6.99,35.56 6.99,45.72
+5V/1  (via drill 0.35)
  Top 0.203: X6.1 78.11,12.18 78.11,17.14 75.18,20.07 72.38,20.07 71.84,19.53 v69.68,19.53 68.37,20.84 TX.A RX.A | R2.2 61.81,23.38 v61.76,23.34
  Top 0.406: D7.A 68.7,10.68 v69.22,10.16 71.12,8.26 74.18,8.26 X6.1
  Bottom 0.203: R27.1 67.9,23.34 | 67.9,23.34 67.9,21.31 v69.68,19.53 | v61.76,23.34 67.9,23.34
BOOT0  (via drill 0.35)
  Top 0.203: IC1.60 34.29,37.66 v34.29,34.92 | v43.66,39.21 45.49,39.21 R7.1 45.41,39.1 D3.C D5.C
  Bottom 0.203: v34.29,34.92 34.29,35.18 35.31,36.2 36.83,36.2 39.85,39.21 v43.66,39.21
BUTTON  (via drill 0.35)
  Top 0.203: IC1.50 39.26,35.56 v40.64,35.56
  Bottom 0.203: v40.64,35.56 40.64,31.11 41.91,29.84 41.91,19.68 43.81,17.78 43.81,10.19 BUT.3
COLOR_OUT  (via drill 0.35)
  Top 0.203: COLOR.6 57.78,50.16 v49.53,50.16 | v46.08,50.16 IC1.61
  Bottom 0.203: v49.53,50.16 v46.08,50.16
COLOR_S0
  Top 0.203: IC1.53 46.03,44.45 COLOR.1
COLOR_S1
  Top 0.203: IC1.54 46.59,45.72 57.15,45.72 COLOR.3
COLOR_S2
  Top 0.203: IC1.57 47.01,48.26 57.15,48.26 COLOR.4
COLOR_S3
  Top 0.203: IC1.56 46.45,46.99 COLOR.2
ENC1_A_3V3
  Top 0.203: R20.2 R22.1 21.69,40.09 IC1.14
ENC1_A_5V
  Top 0.203: ENC.1 15.12,41.79 R20.1
ENC1_B_3V3  (via drill 0.35)
  Top 0.203: R21.2 v18.57,47.54 R23.1 | IC1.15 22.34,38.73 v20.32,38.73
  Bottom 0.203: v18.57,47.54 18.57,39.51 19.35,38.73 v20.32,38.73
ENC1_B_5V
  Top 0.203: ENC.3 17.78,43.18 18.57,43.97 R21.1
ENC2_A_3V3  (via drill 0.35)
  Top 0.203: v21.53,36.75 20.9,36.75 19.79,35.64 R33.1 R31.2 | IC1.22 29.04,31.71 29.04,32.88 v29.82,33.66
  Bottom 0.203: v29.82,33.66 29.79,33.63 24.66,33.63 v21.53,36.75
ENC2_A_5V
  Top 0.203: ENC.2 14.73,37.34 R31.1
ENC2_B_3V3  (via drill 0.35)
  Top 0.203: R34.1 v16.51,47.54 R32.2 | IC1.23 29.84,31.8 v29.84,32.38
  Bottom 0.203: v29.84,32.38 24.56,32.38 16.51,40.43 v16.51,47.54
ENC2_B_5V
  Top 0.203: ENC.4 12.7,44.45 16.43,44.45 R32.1
ESP_CHPD
  Top 0.203: C18.1 43.81,19.68 | R10.1 43.81,19.68 | 43.81,19.68 43.81,11.52 U$1.CH_PD
ESP_RX  (via drill 0.35)
  Top 0.203: IC1.51 39.62,36.63 v41.27,36.63
  Bottom 0.203: v41.27,36.63 41.27,31.75 42.55,30.48 42.55,20.32 44.45,18.41 44.45,15.24 45.72,13.97 48.9,13.97 49.53,13.34 49.53,5.71 48.9,5.08 47.72,5.08 U$1.RX
ESP_TX  (via drill 0.35)
  Top 0.203: v45.72,15.88 45.72,14.61 45.16,14.05 U$1.TX | IC1.52 39.99,37.71 v41.91,37.71
  Bottom 0.203: v41.91,37.71 41.91,32.38 43.18,31.11 43.18,20.95 45.72,18.41 v45.72,15.88
FTDI_BOOT0_OUT  (via drill 0.35)
  Top 0.203: D3.A v48.9,36.99
  Bottom 0.203: v48.9,36.99 54.45,36.99 54.98,36.46 R18.2
  Bottom 0.305: R14.2 R12.2 R26.2 R16.2 R18.2
FTDI_CBUS2  (via drill 0.35)
  Top 0.203: IC4.13 58.02,38.21 v59.18,39.37
  Bottom 0.305: R15.1 59.18,40.48 v59.18,39.37 59.18,38.29 R16.1
FTDI_CBUS3  (via drill 0.35)
  Top 0.203: IC4.14 57.37,38.2 57.15,38.42 v57.15,39.37
  Bottom 0.305: R17.1 57.15,40.44 v57.15,39.37 57.15,38.31 R18.1
FTDI_CBUS4  (via drill 0.35)
  Top 0.203: IC4.12 58.67,38.03 59.07,38.42 59.65,38.42 v60.59,39.37
  Bottom 0.203: R19.1 61.12,39.89 v60.59,39.37 61.12,38.85 R26.1
FTDI_DTRN  (via drill 0.35)
  Top 0.203: IC4.2 65.17,38.27 65.28,38.37 v65.28,39.37
  Bottom 0.305: R13.1 65.28,40.58 v65.28,39.37 65.28,38.19 R14.1
FTDI_RSTN_OUT  (via drill 0.35)
  Top 0.203: D4.C v52.7,41.27
  Bottom 0.203: v52.7,41.27 54.61,41.27 55.65,42.32 56.97,42.32
  Bottom 0.305: 56.97,42.32 R17.2 59.04,42.29 R15.2 R19.2 R11.2 R13.2
FTDI_RTSN  (via drill 0.35)
  Top 0.203: IC4.3 64.52,38.11 63.88,38.75 v63.88,39.37
  Bottom 0.203: R12.1 63.18,38.82 63.73,39.37 | R11.1 63.18,39.92 63.73,39.37 | 63.73,39.37 v63.88,39.37
FTDI_RXLEDN
  Top 0.203: IC4.22 61.92,28.25 63.18,26.99 63.18,25.09 63.66,24.61 R4.2
FTDI_RXLEDN_R
  Top 0.203: R4.1 66.04,24.59 RX.C
FTDI_TXLEDN
  Top 0.203: IC4.23 62.57,28.23 62.87,27.94 63.81,27.94 64.3,27.45 R3.2
FTDI_TXLEDN_R
  Top 0.203: R3.1 67.1,26.71 67.82,25.99 TX.C
GND  (via drill 0.35, 0.7 pad 1.52)
  Top 1.016: M1.GND 31.5,10.16 C16.-
  other vias: 42.8,50.16 37.85,44.76 36.8,50.51 63.27,31.68 79.38,20.32 30.48,34.92 32.38,38.1 26.04,51.44 5.71,49.53 25.4,22.23 43.81,34.92 46.35,30.48 35.31,24.26 17.78,27.94 5.71,37.47 15.88,8.89 18.74,9.4 31.63,1.9 31.75,12.7 33.66,5.71 8.26,37.47 8.89,8.89 1.91,5.08 1.91,12.7 21.28,51.44 51.44,55.24 69.85,55.24 75.56,52.7 76.83,39.37 79.38,34.29 69.85,38.1 77.47,27.94 55.86,22.98 56.52,15.24 38.1,22.86 59.69,6.99 53.98,15.24 71.75,3.81 78.74,2.54 28.58,51.47 50.16,31.75 63.5,50.16 48.9,54.61 61.59,6.99 55.88,27.94 59.56,21.69 60.2,16.13 20.32,47.66 22.86,43.81 28.57,48.9 54.65,40.3 26.04,48.9 10.16,15.88
  pour Top (isolate 0.254): -1.91,61.85 87,61.85 87,-1.91 -1.91,-1.91
  pour Bottom (isolate 0.254): -1.91,61.85 87,61.85 87,-2.54 -1.91,-2.54
  pour Top: 24.13,13.97 35.56,13.97 35.56,6.35 24.13,6.35
  pour Bottom: 35.56,13.97 24.13,13.97 24.13,6.35 35.56,6.35
  pour Top: 74.3,38.1 80.01,38.1 80.01,31.11 74.3,31.11
  pour Bottom: 80.01,38.1 74.3,38.1 74.3,31.11 80.01,31.11
LCD_BACKLIGHT
  Top 0.203: IC1.62 39.05,43.84 Q3.1 39.05,45.9 R6.2
LCD_CONTRAST
  Top 0.203: LCD1.3 13.72,55.49 13.97,55.25 CONT.2
LCD_D4
  Top 0.203: LCD1.11 34.04,54.36 33.02,53.34 25.4,53.34 24.13,52.07 24.13,45.09 26.04,43.18 26.04,39.99 IC1.8
LCD_D5
  Top 0.203: IC1.4 28.57,40.27 28.57,41.27 31.11,43.81 31.11,48.9 36.58,54.36 LCD1.12
LCD_D6
  Top 0.203: LCD1.13 39.12,54.36 37.47,52.7 35.56,52.7 31.75,48.9 31.75,43.81 29.21,41.27 29.21,40.35 IC1.3
LCD_D7
  Top 0.203: IC1.2 29.84,40.42 29.84,41.27 32.38,43.81 32.38,48.9 35.56,52.07 39.37,52.07 41.66,54.36 LCD1.14
LCD_EN
  Top 0.203: IC1.9 25.4,39.91 25.4,43.18 23.5,45.09 23.5,52.07 21.34,54.23 LCD1.6
LCD_K
  Top 0.203: LCD1.16 46.74,53.09 45.53,51.88 R5.2
LCD_RST
  Top 0.203: LCD1.4 16.26,54.23 17.14,53.34 21.27,53.34 22.86,51.75 22.86,45.09 24.77,43.18 24.77,39.84 IC1.10
MOTOR1_IN1  (via drill 0.35)
  Top 0.203: M1.IN1 26.04,2.54 20.32,8.26 v20.32,19.05 | v31.11,31.13 31.11,29.96 IC1.34
  Bottom 0.203: v31.11,31.13 31.11,28.42 29.37,26.67 24.61,26.67 20.32,22.38 v20.32,19.05
MOTOR1_IN2
  Top 0.203: M1.IN2 24.77,5.08 21.8,8.04 21.8,21.64 IC1.26
MOTOR2_IN1  (via drill 0.35)
  Top 0.203: v32.38,31.11 32.38,29.39 IC1.35
  Bottom 0.203: v32.38,31.11 32.38,28.33 30.09,26.04 25.24,26.04 22.13,22.92 22.13,17.24 26.67,12.7 M1.IN3
MOTOR2_IN2
  Top 0.203: M1.IN4 25.4,15.24 22.54,18.1 22.54,21.67 IC1.27
MOTOR_FAULTN
  Top 0.203: M1.!FAULT 15.24,2.54 17.14,4.45 17.14,17.14 17.14,18.4 IC1.24
MOTOR_SLEEPN  (via drill 0.35)
  Top 0.203: IC1.25 18.8,19.34 v18.8,15.24 R25.2
  Bottom 0.203: M1.!SLEEP v18.8,15.24
N$1
  Top 0.203: R5.1 41.09,51.88 40.01,50.8 Q3.3
N$2
  Top 0.203: R9.1 52.63,37.25 Q2.1 52.49,37.1 C17.2
N$3
  Top 0.406: Q1.8 69.85,30.31 70.81,31.27 70.96,31.27 71.12,31.11 Q1.7 | Q1.6 72.39,31.11 | Q1.5 73.66,31.11
  Top 1.016: X2.1 75.51,31.11 73.66,31.11 72.39,31.11 71.12,31.11
N$4  (via drill 0.35)
  Top 0.203: C17.1 55.88,34.92 56.13,34.68 v57.23,34.68
  Bottom 0.203: v57.23,34.68 67.23,34.68 67.9,34.01 R27.2
N$8  (via drill 0.35)
  Top 0.203: v48.9,34.92 D5.A
  Bottom 0.203: v48.9,34.92 v48.91,34.91 R28.2
N$12
  Top 0.813: MOT1.2 5.24,14.45 5.71,13.97 JP6.2 9.53,13.97 10.79,12.7 M1.OUT1
N$13
  Top 0.813: MOT1.1 5.24,10.95 5.71,11.43 JP6.1 9.53,11.43 10.79,10.16 M1.OUT2
N$14
  Top 0.813: MOT2.2 5.24,6.83 5.71,6.35 JP7.2 9.53,6.35 10.79,7.62 M1.OUT3
N$15
  Top 0.813: MOT2.1 5.24,3.33 5.71,3.81 JP7.1 9.53,3.81 10.79,5.08 M1.OUT4
OSCIN
  Top 0.203: X1.1 28.54,44.73 27.63,43.81 27.63,40.51 IC1.5
OSCOUT
  Top 0.203: X1.3 26.14,44.65 26.99,43.8 26.99,40.44 IC1.6
PA2  (via drill 0.7 pad 1.52)
  Top 0.203: IC1.16 25.66,34.66 24.77,35.56 23.51,35.56 21.6,33.66 18.41,33.66 v17.78,33.02
PA3  (via drill 0.7 pad 1.52)
  Top 0.203: IC1.17 24.91,31.11 24.13,31.11 22.86,32.38 21.01,32.38 19.11,30.48 v17.78,30.48
PA4  (via drill 0.35 pad 0.75, 0.7 pad 1.52)
  Top 0.203: IC1.20 21.95,26.04 v19.68,26.04
  Bottom 0.203: v15.24,30.48 16.51,29.21 16.51,26.67 17.14,26.04 v19.68,26.04
PA8  (via drill 0.7 pad 1.52)
  Top 0.203: IC1.41 41.26,24.77 46.99,24.77 48.9,26.67 v50.16,26.67
PA11  (via drill 0.7 pad 1.52)
  Top 0.203: IC1.44 40.1,28.04 51.49,28.04 52.7,26.83 v52.7,26.67
PA12  (via drill 0.7 pad 1.52)
  Top 0.203: IC1.45 40.14,28.71 47.12,28.71 48.9,30.48 51.44,30.48 v52.7,29.21
PB10  (via drill 0.7 pad 1.52)
  Top 0.203: IC1.29 26.67,24.39 v26.67,23.5
PB11  (via drill 0.7 pad 1.52)
  Top 0.203: IC1.30 29.21,26.22 v29.21,23.5
PC3  (via drill 0.69 pad 1.52)
  Top 0.203: IC1.11 28.57,35.33 28.57,34.92 26.71,33.06 20.38,33.06 19.07,31.75 16.51,31.75 v15.24,33.02
PC6  (via drill 0.75 pad 1.52)
  Top 0.203: IC1.37 40.97,22.23 49.53,22.23 v50.16,21.59
PC7  (via drill 0.75 pad 1.52)
  Top 0.203: IC1.38 41.04,22.86 51.44,22.86 v52.7,21.59
PC8  (via drill 0.7 pad 1.52)
  Top 0.203: IC1.39 41.11,23.5 49.53,23.5 v50.16,24.13
PC9  (via drill 0.75 pad 1.52)
  Top 0.203: IC1.40 41.18,24.13 47.62,24.13 48.74,25.24 51.59,25.24 v52.7,24.13
RSTN  (via drill 0.35)
  Top 0.203: IC1.7 30.53,36.2 v31.75,36.2 v36.2,31.75 | U$1.RST 43.88,6.35 41.27,6.35 40.01,7.62 v40.01,14.93 | D6.A v40.01,14.93 | v40.01,14.93 41.82,16.74 RST.3 | R29.2 49.22,43.08 48.99,43.31 48.26,43.31 | v46.61,43.31 48.26,43.31 | 48.26,41.27 48.26,43.31 | C15.1 48.24,41.29 48.26,41.27 | D4.A 48.26,41.27 | Q2.3 50.16,38.27 50.16,39.21 49.7,39.68 48.75,39.68 48.26,40.17 48.26,41.27
  Bottom 0.203: v31.75,36.2 32.38,36.83 34.29,36.83 40.77,43.31 v46.61,43.31 | v36.2,31.75 38.73,31.75 40.64,29.84 40.64,19.62 40.01,18.99 v40.01,14.93
SERVO  (via drill 0.35)
  Top 0.203: IC1.36 33.19,29.3 33.19,31.58 v32.38,32.38 | v17.4,22.61 17.46,22.55 Q4.1
  Bottom 0.203: v32.38,32.38 31.11,32.38 29.84,31.11 29.84,28.26 29.27,27.69 23.24,27.69 18.16,22.61 v17.4,22.61
SERVO_5V
  Top 0.203: SERVO.1 11.01,30.06 R8.2 11.01,26.25 9.06,24.3 Q4.3
SWD_RSTN
  Top 0.203: SWD.5 26.67,17.78 27.62,16.82 D6.C
SWD_SWCLK  (via drill 0.35)
  Top 0.203: v36.83,33.66 38.06,33.66 IC1.49
  Bottom 0.203: SWD.2 34.29,21.59 36.2,23.5 36.2,24.77 34.92,26.04 34.92,31.75 v36.83,33.66
SWD_SWDIO  (via drill 0.35)
  Top 0.203: IC1.46 37.17,32.38 36.83,32.38 v35.56,33.66
  Bottom 0.203: SWD.4 29.21,21.59 29.84,22.23 33.02,22.23 34.29,23.5 34.29,32.38 v35.56,33.66
SWD_SWO  (via drill 0.35)
  Top 0.203: IC1.55 35.56,35.4 v35.56,34.92
  Bottom 0.203: SWD.6 24.13,23.65 25.88,25.4 31.75,25.4 33.66,27.3 33.66,33.02 v35.56,34.92
US_ECHO
  Top 0.203: US.3 67.96,45.09 65.41,47.64 65.41,50.18 64.15,51.44 49.48,51.44 IC1.58
US_TRIG
  Top 0.203: US.2 67.94,47.62 66.87,48.7 R30.2 50.04,52.7 IC1.59
USART1_RX  (via drill 0.35)
  Top 0.203: v65.79,33.5 65.79,36.61 IC4.1 | IC1.43 40.13,27.3 45.72,27.3 v46.95,26.07
  Bottom 0.203: v65.79,33.5 65.79,32.38 64.14,30.73 56.78,30.73 54.92,28.87 54.92,26.67 53.81,25.56 47.47,25.56 v46.95,26.07
USART1_TX  (via drill 0.35)
  Top 0.203: IC1.42 40.06,26.67 45.09,26.67 v45.68,26.07 | IC4.5 63.22,33.52 v63.25,33.5
  Bottom 0.203: v63.25,33.5 61.75,32 57.4,32 53.18,27.78 47.39,27.78 v45.68,26.07
USB_DM
  Top 0.203: X6.2 74.69,14.61 71.75,14.61 67,19.36 D1.3
USB_DM_FTDI
  Top 0.203: D1.4 60.01,19.36 58.02,21.36 IC4.16
USB_DP
  Top 0.203: D1.1 67.94,17.46 70.48,14.92 70.48,12.7 71.12,12.06 72.29,12.06 X6.3
USB_DP_FTDI
  Top 0.203: D1.6 60.64,17.46 57.37,20.73 IC4.15
USB_PWR_DET  (via drill 0.35)
  Top 0.203: v60.07,33.18 59.97,33.08 IC4.19 59.97,26.81 R1.2 R2.1 | v52.7,33.18 52.7,31.11 54.3,29.52 54.3,20.97 53.65,20.32 48.9,20.32 47.62,21.59 40.64,21.59 36.83,25.4 34.97,25.4 IC1.33
  Bottom 0.203: v60.07,33.18 v52.7,33.18 52.7,34.74 R28.1
VCC
  Top 0.203: R24.1 25.57,7.62 M1.VCC
  Top 0.406: IC2.1 61.6,4.71 62.23,4.08 C11.1 66.56,4.08 C10.+ 66.67,1.91 | Q1.3 72.39,20.95 | 70.81,20.95 70.48,20.95 69.85,21.59 Q1.1 | Q1.2 71.12,20.95
  Top 0.813: 31.5,7.62 C16.+
  Top 1.016: M1.VCC 31.5,7.62 | C16.+ 31.75,3.81 33.66,1.91 66.67,1.91 76.2,1.91 79.38,5.08 79.38,18.41 76.83,20.95 72.39,20.95 71.12,20.95 70.81,20.95
VCC_SENSE  (via drill 0.35)
  Top 0.203: R24.2 25.36,10.42 | R35.1 25.36,10.42 | 25.36,10.42 23.87,10.42 22.86,11.43 v22.86,14.61 | IC1.21 19.05,22.42 v19.05,21.59
  Bottom 0.203: v22.86,14.61 19.05,18.41 v19.05,21.59

### Text on the board
tNames: 212585212 | O / RS / IO / GN / CL / 33
bNames: PCB design: ksstms 2020 / github.com/legokor/TanfolyamRobot | RSTn | DTRn / RTSn / CBUS4 / CBUS2 / CBUS3 | BOOT0 | USB BOOT0 | USB RSTn | PB11 / PB10 | PA2 PC3 / PA3 PA4 / GND 3V3 | GND / 3V3 / PA8 / PC8 / PC6 | PA12 / PA11 / PC9 / PC7